# EAGLE design utilidong-soc-mk-1.0 (EAGLE 7.5.0)
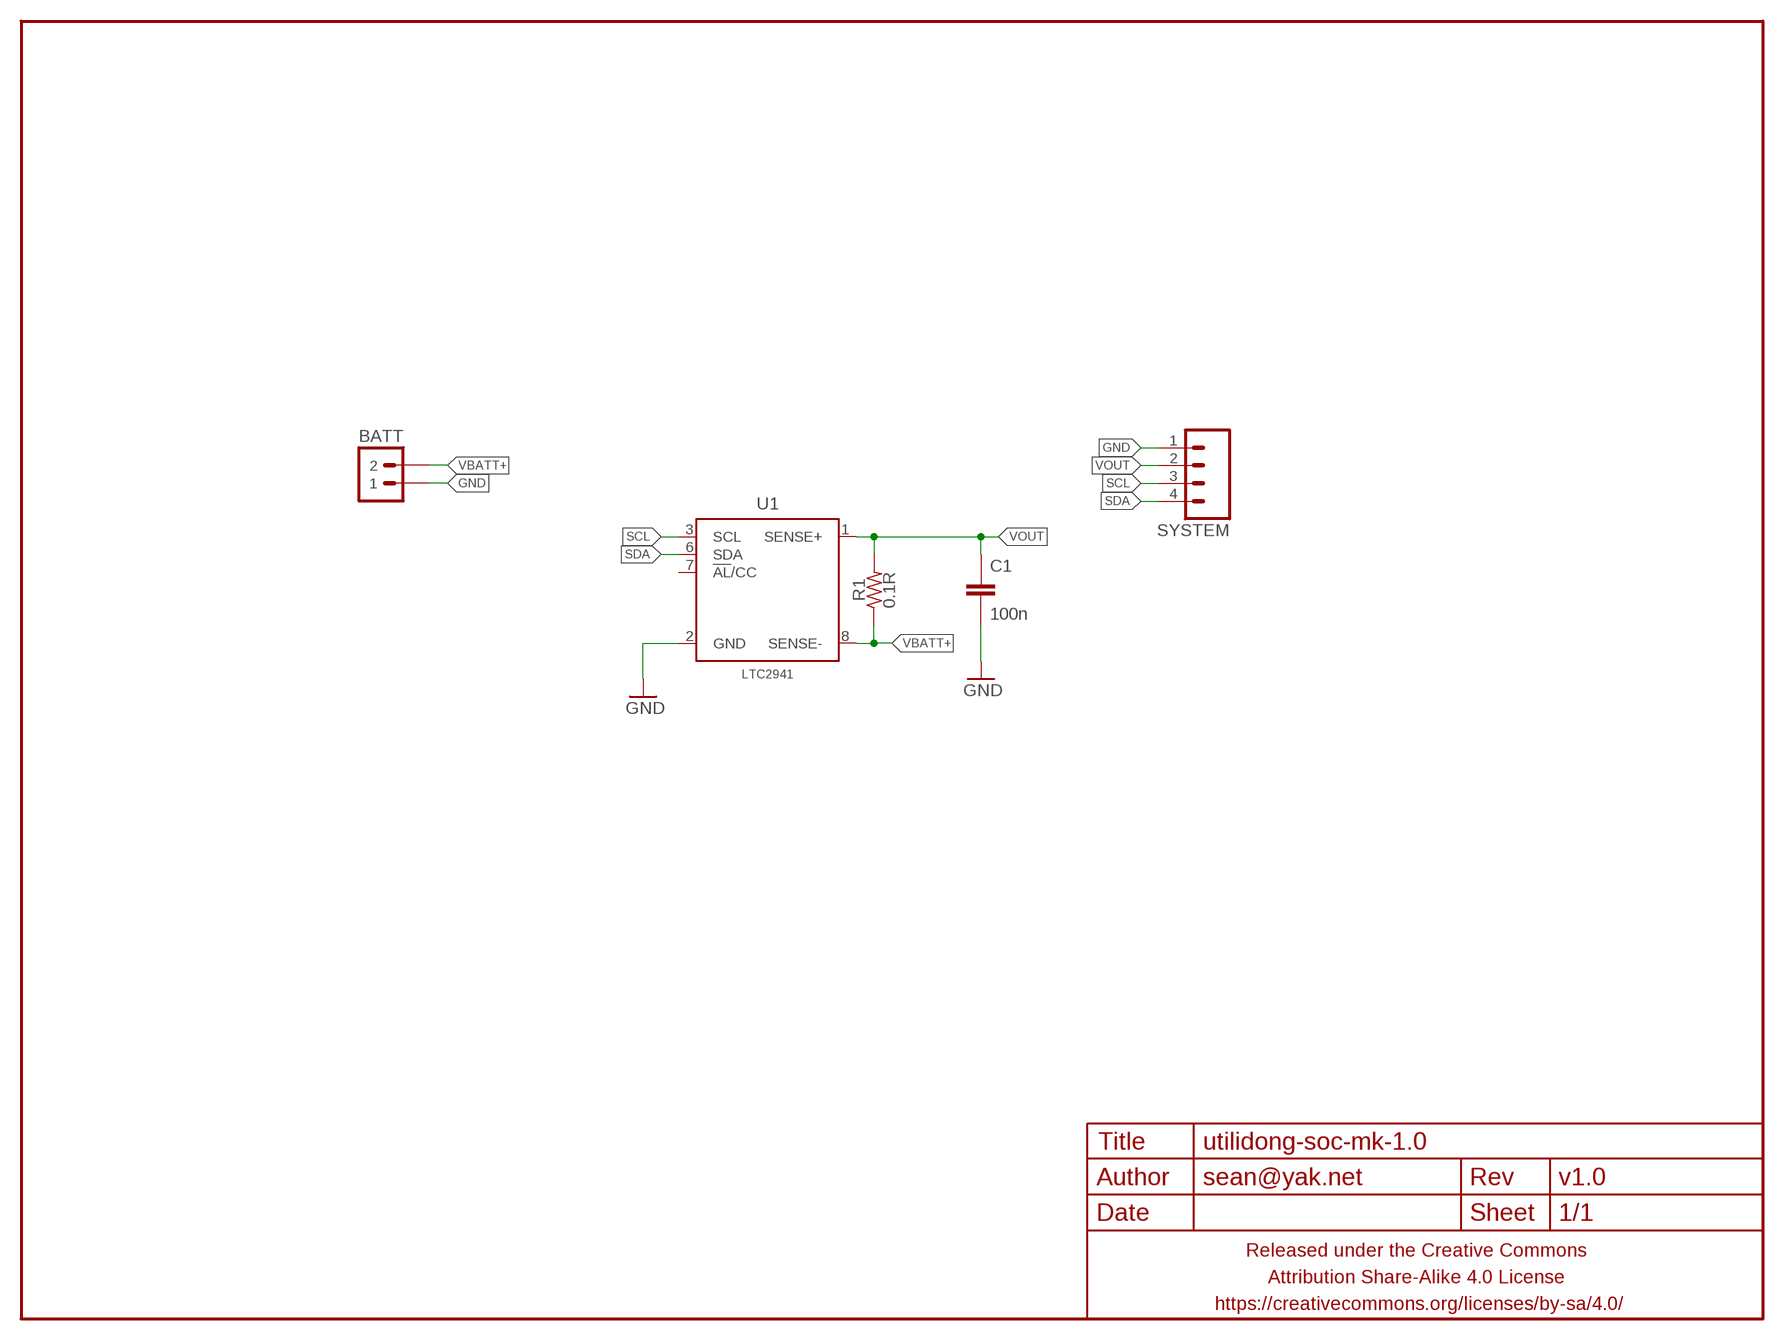
[diagram p0: schematic, sheet 1]

## Parts
BATT  M02PTH-CENTERED-R+  [1X02-CENTER-R+]
C1  100n  CAPACITOR-CERAMICC0603  [C0603]
FRAME1  FRAME-LETTERNO_PACKAGE  [DUMMY]
R1  0.1R  RESISTORR1206  [R1206]
SYSTEM  M04PTH-CENTERED  [1X04-PTH-VERT-CENTER]
U1  LTC2941  LTC2941MSOP-8  [MSOP-8]

## Nets
GND: BATT.1 C1.2 SYSTEM.1 U1.2(GND)
SCL: SYSTEM.3 U1.3(SCL)
SDA: SYSTEM.4 U1.6(SDA)
VBATT+: BATT.2 R1.1 U1.8(SENSE-)
VOUT: C1.1 R1.2 SYSTEM.2 U1.1(SENSE+)
Unconnected: U1.7(!AL!/CC)

## Library data of the parts
BATT = A_butts:M02: Standard 2-pin 0.1" header. Use with - straight break away headers ( PRT-00116) - right angle break away headers (PRT-00553) - swiss pins (PRT-00743) - machine pins (PRT-00117) - female headers (PRT-00115) Molex polarized connector foot print use with: PRT-08233 with associated crimp pins and housings. 2.54_SCREWTERM for use with PRT-10571. 3.5mm Screw Terminal footprints for PRT-08084 5mm Screw Terminal footprints for use with PRT-08433
C1 = a_parts:CAPACITOR-CERAMIC: CAPACITOR, European symbol
FRAME1 = A_butts:FRAME-LETTER: Schematic Frame Standard 8.5x11 US Letter frame; DESIGNER: sean@yak.net; VERSION: v1.0
R1 = A_butts:RESISTOR: RESISTOR, American symbol
SYSTEM = a_parts:M04: Header 4 Standard 4-pin 0.1" header. Use with straight break away headers (SKU : PRT-00116), right angle break away headers (PRT-00553), swiss pins (PRT-00743), machine pins (PRT-00117), and female headers (PRT-00115). Molex polarized connector foot print use with SKU : PRT-08231 with associated crimp pins and housings. 1MM SMD Version SKU: PRT-10208
U1 = a_parts:LTC2941

## Board
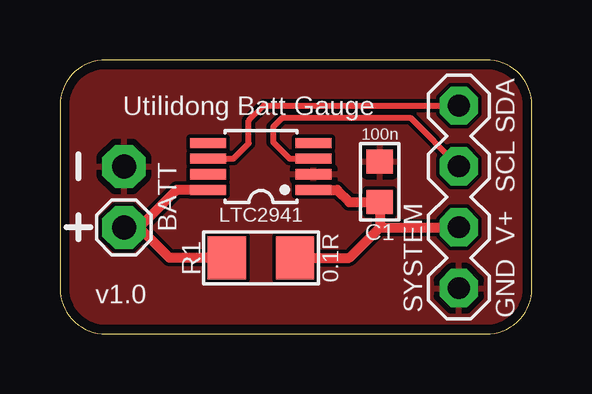
[diagram p1: board, top side]
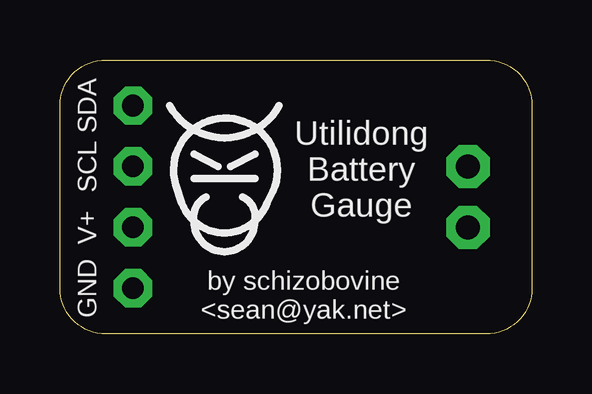
[diagram p2: board, bottom side, seen from below]

Size 19.68 x 11.43 mm. Coordinates in mm from the lower left corner, seen from the top.
Outline: 17.78,11.43 1.91,11.43 arc90 0,9.53 0,1.91 arc90 1.91,0 17.78,0 arc90 19.68,1.91 19.68,9.53 arc90 17.78,11.43
Copper layers (1*16): Top 0.0356mm / dielectric 1.5011mm / Bottom 0.0356mm
Design rules "LaenPCBOrder_2": minimum track width 6mil, minimum drill 13mil, track to track 6mil, track to pad 6mil, pad to pad 6mil, via to via 6mil, smd to smd 6mil, copper to edge 15mil, drill to drill 6mil, minimum pad ring 7mil, minimum via ring 7mil, stop-mask expansion 3mil, vias tented up to drill 20mil, thermal gap 10mil

### Footprints (pad centres in the part's own frame; a part is rotated, then mirrored left to right if it is on the bottom)
1X02-CENTER-R+ = drill 1 pad 1.8 octagon: 1 -1.27,0; 2 1.27,0
C0603 = smd 1 x 1.1: 1 -0.85,0; 2 0.85,0
R1206 = smd 1.6 x 1.8: 1 -1.42,0; 2 1.42,0
1X04-PTH-VERT-CENTER = drill 0.9 pad 1.6 octagon: 1 -3.81,0; 2 -1.27,0; 3 1.27,0; 4 3.81,0
MSOP-8 = smd 1.5 x 0.42: 1 -2.2,0.975; 2 -2.2,0.325; 3 -2.2,-0.325; 4 -2.2,-0.975; 5 2.2,-0.975; 6 2.2,-0.325; 7 2.2,0.325; 8 2.2,0.975

### Placement (x,y rotation side)
BATT  2.67,5.71 270 top
C1  13.34,6.35 90 top
FRAME1  0,0 0 top
R1  8.38,3.17 0 top
SYSTEM  16.64,5.71 90 top
U1  8.38,6.99 180 top
U$1  [COW_SMALL_NOTEXT]  12.83,6.99 0 bottom

### Tracks (layer width: path | path; a pad name or v marks a point on that pad's centre or on a via)
GND
  pour Top (rank 6): 17.78,0 1.91,0 arc-90 0,1.91 0,9.53 arc-90 1.91,11.43 17.78,11.43 arc-90 19.68,9.53 19.68,1.91 arc-90
SCL
  Top 0.254: SYSTEM.3 14.61,9.02 9.27,9.02 8.89,8.64 8.89,8 9.58,7.31 U1.3
SDA
  Top 0.254: U1.6 7.24,7.31 7.87,7.95 7.87,8.89 8.51,9.53 SYSTEM.4
VBATT+
  Top 0.406: U1.8 4.87,6.01 3.3,4.45 | 3.3,4.45 BATT.2 | R1.1 4.57,3.17 3.3,4.45
VOUT
  Top 0.406: R1.2 12.06,3.17 13.34,4.45 | 13.34,4.45 SYSTEM.2 | 13.34,4.45 C1.1 12.07,5.5 11.56,6.01 U1.1

### Text on the board
tPlace: Utilidong Batt Gauge | SDA | SCL | V+ | GND
bPlace: SDA | Utilidong / Battery / Gauge | SCL | V+ | GND | by schizobovine / <sean@yak.net>